# EAGLE design ESP32 DSP (EAGLE 9.6.2)
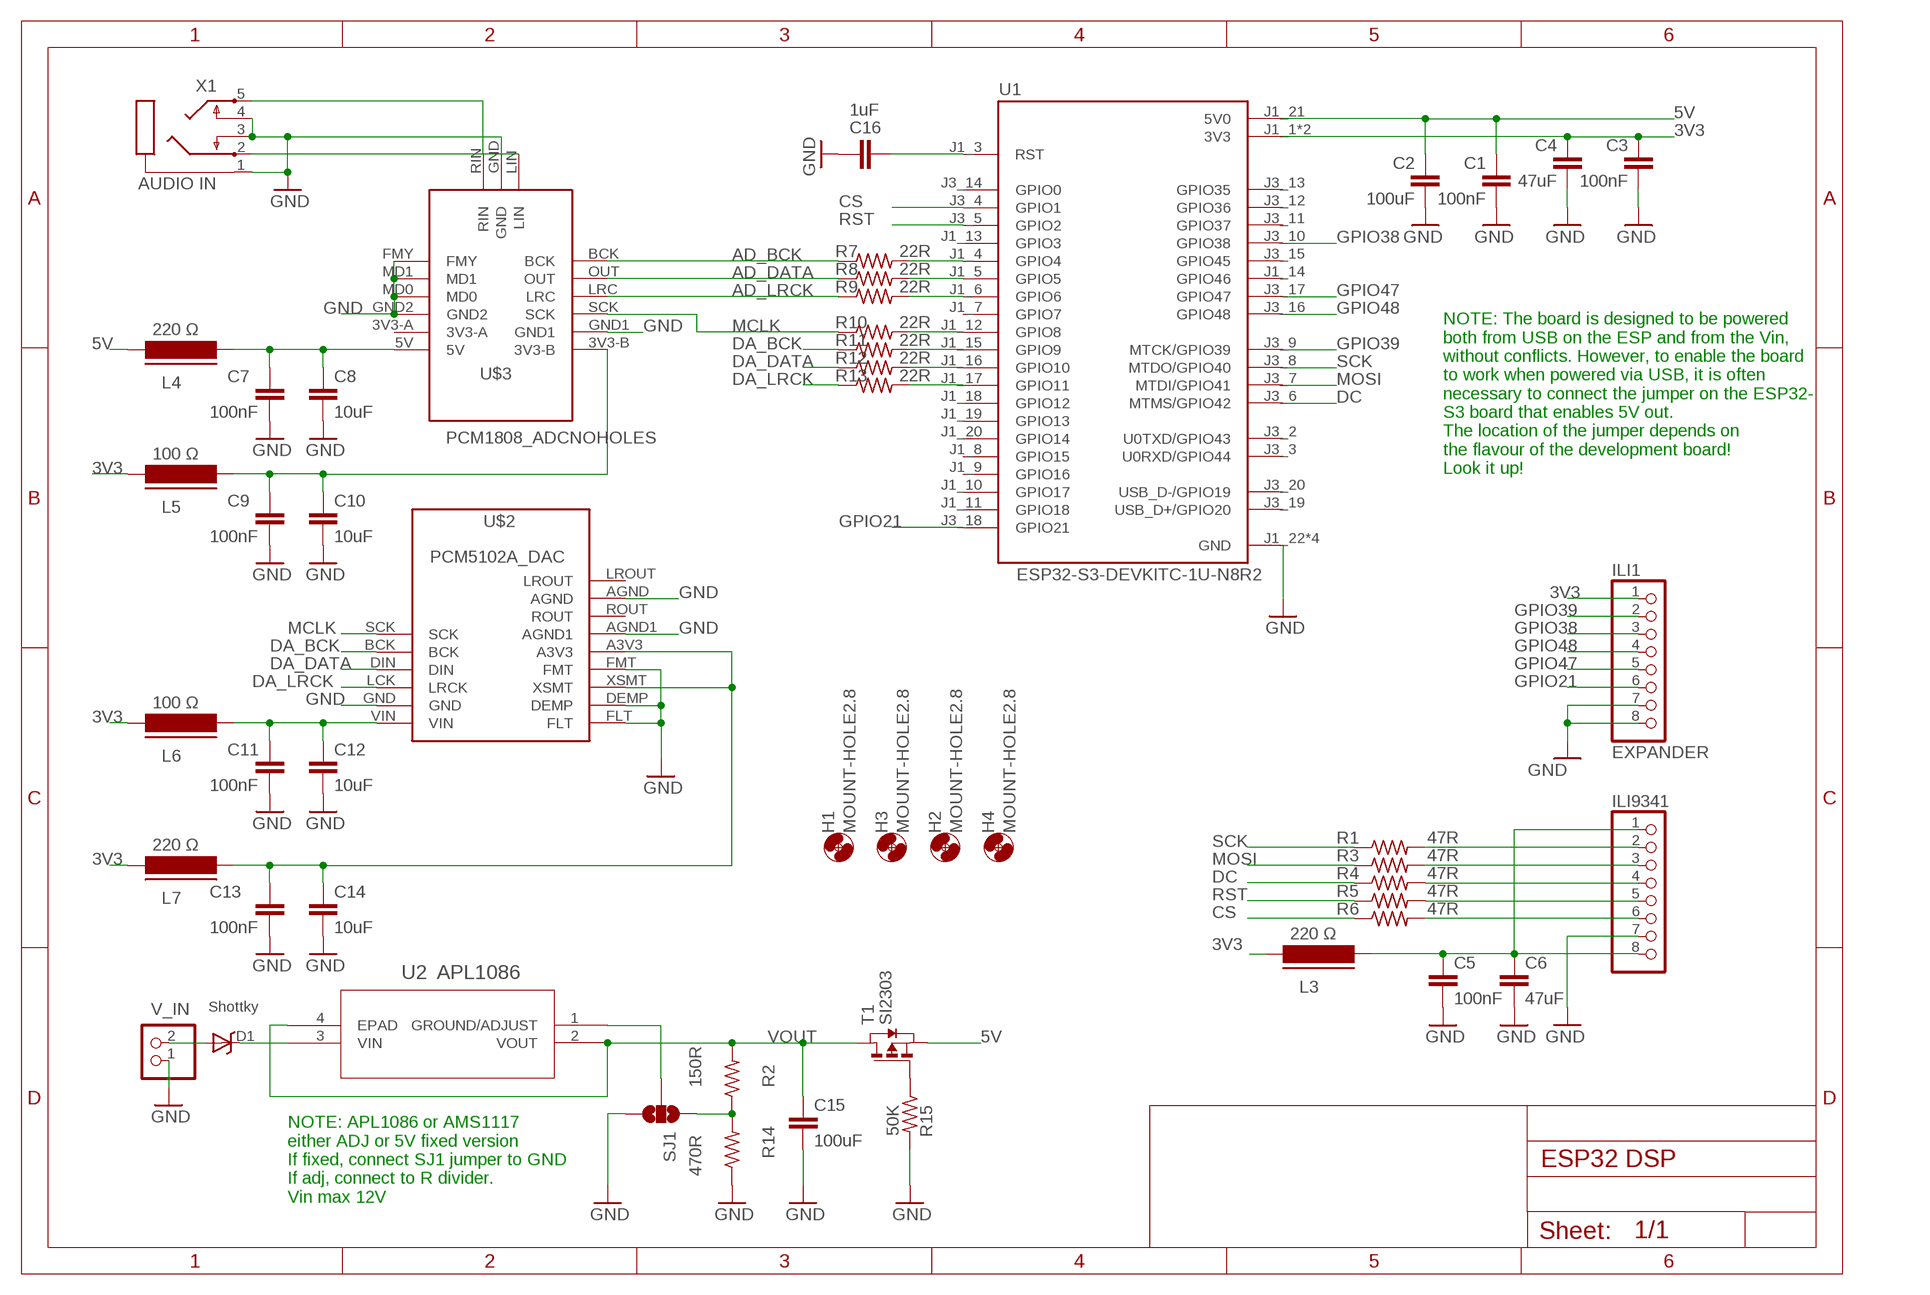
[diagram p0: schematic, sheet 1]

## Parts
C1  100nF  C-EUC0805  [C0805]
C2  100uF  C-EUC0805  [C0805]
C3  100nF  C-EUC0805  [C0805]
C4  47uF  C-EUC0805  [C0805]
C5  100nF  C-EUC0805  [C0805]
C6  47uF  C-EUC0805  [C0805]
C7  100nF  C-EUC0805  [C0805]
C8  10uF  C-EUC0805  [C0805]
C9  100nF  C-EUC0805  [C0805]
C10  10uF  C-EUC0805  [C0805]
C11  100nF  C-EUC0805  [C0805]
C12  10uF  C-EUC0805  [C0805]
C13  100nF  C-EUC0805  [C0805]
C14  10uF  C-EUC0805  [C0805]
C15  100uF  C-EUC0805  [C0805]
C16  1uF  C-EUC0805  [C0805]
D1  Shottky  DIODE-SCHOTTKYSMA-403D  [SMA-403D]
H1  MOUNT-HOLE2.8  [2,8]
H2  MOUNT-HOLE2.8  [2,8]
H3  MOUNT-HOLE2.8  [2,8]
H4  MOUNT-HOLE2.8  [2,8]
ILI1  EXPANDER  PINHD-1X8  [1X08]
ILI9341  PINHD-1X8  [1X08]
L3  220 Ω  FERRITE-0805  [FB805]
L4  220 Ω  FERRITE-0805  [FB805]
L5  100 Ω  FERRITE-0805  [FB805]
L6  100 Ω  FERRITE-0805  [FB805]
L7  220 Ω  FERRITE-0805  [FB805]
R1  47R  R-US_M0805  [M0805]
R2  150R  R-US_M0805  [M0805]
R3  47R  R-US_M0805  [M0805]
R4  47R  R-US_M0805  [M0805]
R5  47R  R-US_M0805  [M0805]
R6  47R  R-US_M0805  [M0805]
R7  22R  R-US_M0805  [M0805]
R8  22R  R-US_M0805  [M0805]
R9  22R  R-US_M0805  [M0805]
R10  22R  R-US_M0805  [M0805]
R11  22R  R-US_M0805  [M0805]
R12  22R  R-US_M0805  [M0805]
R13  22R  R-US_M0805  [M0805]
R14  470R  R-US_M0805  [M0805]
R15  50K  R-US_M0805  [M0805]
SJ1  SOLDERJUMPER_2WAYS  [SJ_3]
T1  SI2303  PMOSSOT23  [SOT-23]
U1  ESP32-S3-DEVKITC-1U-N8R2  [XCVR_ESP32-S3-DEVKITC-1U-N8R2]
U2  APL1086  [SOT_AMS_ADS]
U$2  PCM5102A_DAC  [I2S_PCM_5100_SOUNDCARD]
U$3  PCM1808_ADCNOHOLES  [CMJCU-1808-NOHOLES]
V_IN  5V  PINHD-1X2  [1X02]
X1  AUDIO IN  STEREOJACK  [STX3100]

## Nets
3V3: C3.1 C4.1 ILI1.1 L3.1 L5.1 L6.1 L7.1 U1.J1_1(3V3) U1.J1_2(3V3)
5V: C1.1 C2.1 L4.1 T1.2(S) U1.J1_21(5V0)
AD_BCK: R7.1 U$3.BCK
AD_DATA: R8.1 U$3.OUT
AD_LRCK: R9.1 U$3.LRC
CS: R6.1 U1.J3_4(GPIO1)
DA_BCK: R11.1 U$2.BCK
DA_DATA: R12.1 U$2.DIN
DA_LRCK: R13.1 U$2.LCK(LRCK)
DC: R4.1 U1.J3_6(MTMS/GPIO42)
GND: C1.2 C2.2 C3.2 C4.2 C5.2 C6.2 C7.2 C8.2 C9.2 C10.2 C11.2 C12.2 C13.2 C14.2 C15.2 C16.2 ILI1.7 ILI1.8 ILI9341.7 R14.1 R15.2 SJ1.3 U1.J1_22(GND) U1.J3_1(GND) U1.J3_21(GND) U1.J3_22(GND) U$2.AGND U$2.AGND1 U$2.DEMP U$2.FLT U$2.FMT U$2.GND U$3.FMY U$3.GND U$3.GND1 U$3.GND2 U$3.MD0 U$3.MD1 V_IN.1 X1.1 X1.3 X1.4
GPIO21: ILI1.6 U1.J3_18(GPIO21)
GPIO38: ILI1.3 U1.J3_10(GPIO38)
GPIO39: ILI1.2 U1.J3_9(MTCK/GPIO39)
GPIO47: ILI1.5 U1.J3_17(GPIO47)
GPIO48: ILI1.4 U1.J3_16(GPIO48)
MCLK: R10.1 U$2.SCK U$3.SCK
MOSI: R3.1 U1.J3_7(MTDI/GPIO41)
N$1: ILI9341.2 R1.2
N$2: ILI9341.3 R3.2
N$3: ILI9341.4 R4.2
N$4: ILI9341.5 R5.2
N$5: ILI9341.6 R6.2
N$6: C11.1 C12.1 L6.2 U$2.VIN
N$7: C13.1 C14.1 L7.2 U$2.A3V3 U$2.XSMT
N$8: U$3.RIN X1.5
N$9: U$3.LIN X1.2
N$10: R2.1 R14.2 SJ1.1
N$11: D1.C U2.3(VIN)
N$12: C16.1 U1.J1_3(RST)
N$13: SJ1.2 U2.1(GROUND/ADJUST)
N$85: R15.1 T1.3(G)
N$100: R7.2 U1.J1_4(GPIO4)
N$101: R8.2 U1.J1_5(GPIO5)
N$102: R9.2 U1.J1_6(GPIO6)
N$103: R10.2 U1.J1_12(GPIO8)
N$104: R11.2 U1.J1_15(GPIO9)
N$105: R12.2 U1.J1_16(GPIO10)
N$106: R13.2 U1.J1_17(GPIO11)
N$227: C9.1 C10.1 L5.2 U$3.3V3-B
N$244: C7.1 C8.1 L4.2 U$3.5V
N$333: C5.1 C6.1 ILI9341.1 ILI9341.8 L3.2
RST: R5.1 U1.J3_5(GPIO2)
SCK: R1.1 U1.J3_8(MTDO/GPIO40)
V_IN: D1.A V_IN.2
VOUT: C15.1 R2.2 T1.1(D) U2.2(VOUT) U2.4(EPAD)
Unconnected: U1.J1_7(GPIO7) U1.J1_8(GPIO15) U1.J1_9(GPIO16) U1.J1_10(GPIO17) U1.J1_11(GPIO18) U1.J1_13(GPIO3) U1.J1_14(GPIO46) U1.J1_18(GPIO12) U1.J1_19(GPIO13) U1.J1_20(GPIO14) U1.J3_2(U0TXD/GPIO43) U1.J3_3(U0RXD/GPIO44) U1.J3_11(GPIO37) U1.J3_12(GPIO36) U1.J3_13(GPIO35) U1.J3_14(GPIO0) U1.J3_15(GPIO45) U1.J3_19(USB_D+/GPIO20) U1.J3_20(USB_D-/GPIO19) U$2.LROUT U$2.ROUT U$3.3V3-A

## Notes on the sheet
- NOTE: The board is designed to be powered 
  both from USB on the ESP and from the Vin, 
  without conflicts. However, to enable the board 
  to work when powered via USB, it is often 
  necessary to connect the jumper on the ESP32-
  S3 board that enables 5V out. 
  The location of the jumper depends on 
  the flavour of the development board!
  Look it up!
- NOTE: APL1086 or AMS1117
  either ADJ or 5V fixed version
  If fixed, connect SJ1 jumper to GND
  If adj, connect to R divider.
  Vin max 12V

## Library data of the parts
C1-C16 = rcl:C-EU: CAPACITOR, European symbol
D1 = Ai_DiscreteSemis:DIODE-SCHOTTKY: Commonly MBRA140.
H1-H4 = holes:MOUNT-HOLE: MOUNTING HOLE with drill center marker
ILI1 ILI9341 = pinhead:PINHD-1X8: PIN HEADER
L3-L7 = Dangerous Prototypes_devices:FERRITE: Ferrite bead in various packages
R1-R15 = adafruit:R-US_: RESISTOR, American symbol
SJ1 = SparkFun-Passives:SOLDERJUMPER_2WAY: Solder Jumper 2 way solder jumper
T1 = zetex:PMOSSOT23: MOS FET; OC_FARNELL: unknown; OC_NEWARK: unknown
U1 = ESP32-S3-DEVKITC-1U-N8R2:ESP32-S3-DEVKITC-1U-N8R2: Check availability <https://pricing.snapeda.com/parts/ESP32-S3-DEVKITC-1U-N8R2/Espressif%20Systems/view-part?ref=eda>; AVAILABILITY: In Stock; CHECK_PRICES: https://www.snapeda.com/parts/ESP32-S3-DEVKITC-1U-N8R2/Espressif+Systems/view-part/?ref=eda; DESCRIPTION: The ESP32-S3-DEVKITC-1U-N8R2 Evaluation Board from Espressif Systems is a versatile development platform designed for wireless communication applications. It features the ESP32-S3-WROOM-1U-N8R2 transceiver, supporting 802.11 b/g/n Wi-Fi and Bluetooth® 5.x BLE at 2.4GHz, ensuring reliable connectivity. Equipped with 8MB Quad SPI Flash and 2MB Quad SPI, along with 512KB SRAM and 384KB ROM, the board provides ample memory for handling complex tasks efficiently.; MF: Espressif Systems; MP: ESP32-S3-DEVKITC-1U-N8R2; PACKAGE: None; PRICE: None; SNAPEDA_LINK: https://www.snapeda.com/parts/ESP32-S3-DEVKITC-1U-N8R2/Espressif+Systems/view-part/?ref=snap
U2 = APL1086:APL1086; COPYRIGHT: Copyright (C) 2025 Ultra Librarian. All rights reserved.; MANUFACTURER_NAME: Advanced Monolithic Systems; MANUFACTURER_PART_NUMBER: AMS1117-3.3
U$2 = PCM5102A Module:PCM5102A_DAC
U$3 = CJMCU-1808:PCM1808_ADC
V_IN = pinhead:PINHD-1X2: PIN HEADER
X1 = adafruit:STEREOJACK: MIC/HEADPHONE JACK Stereo jack with two switches. Kycon STX3100, CUI SJ1-3555NG and/or 4UCon 05544

## Board
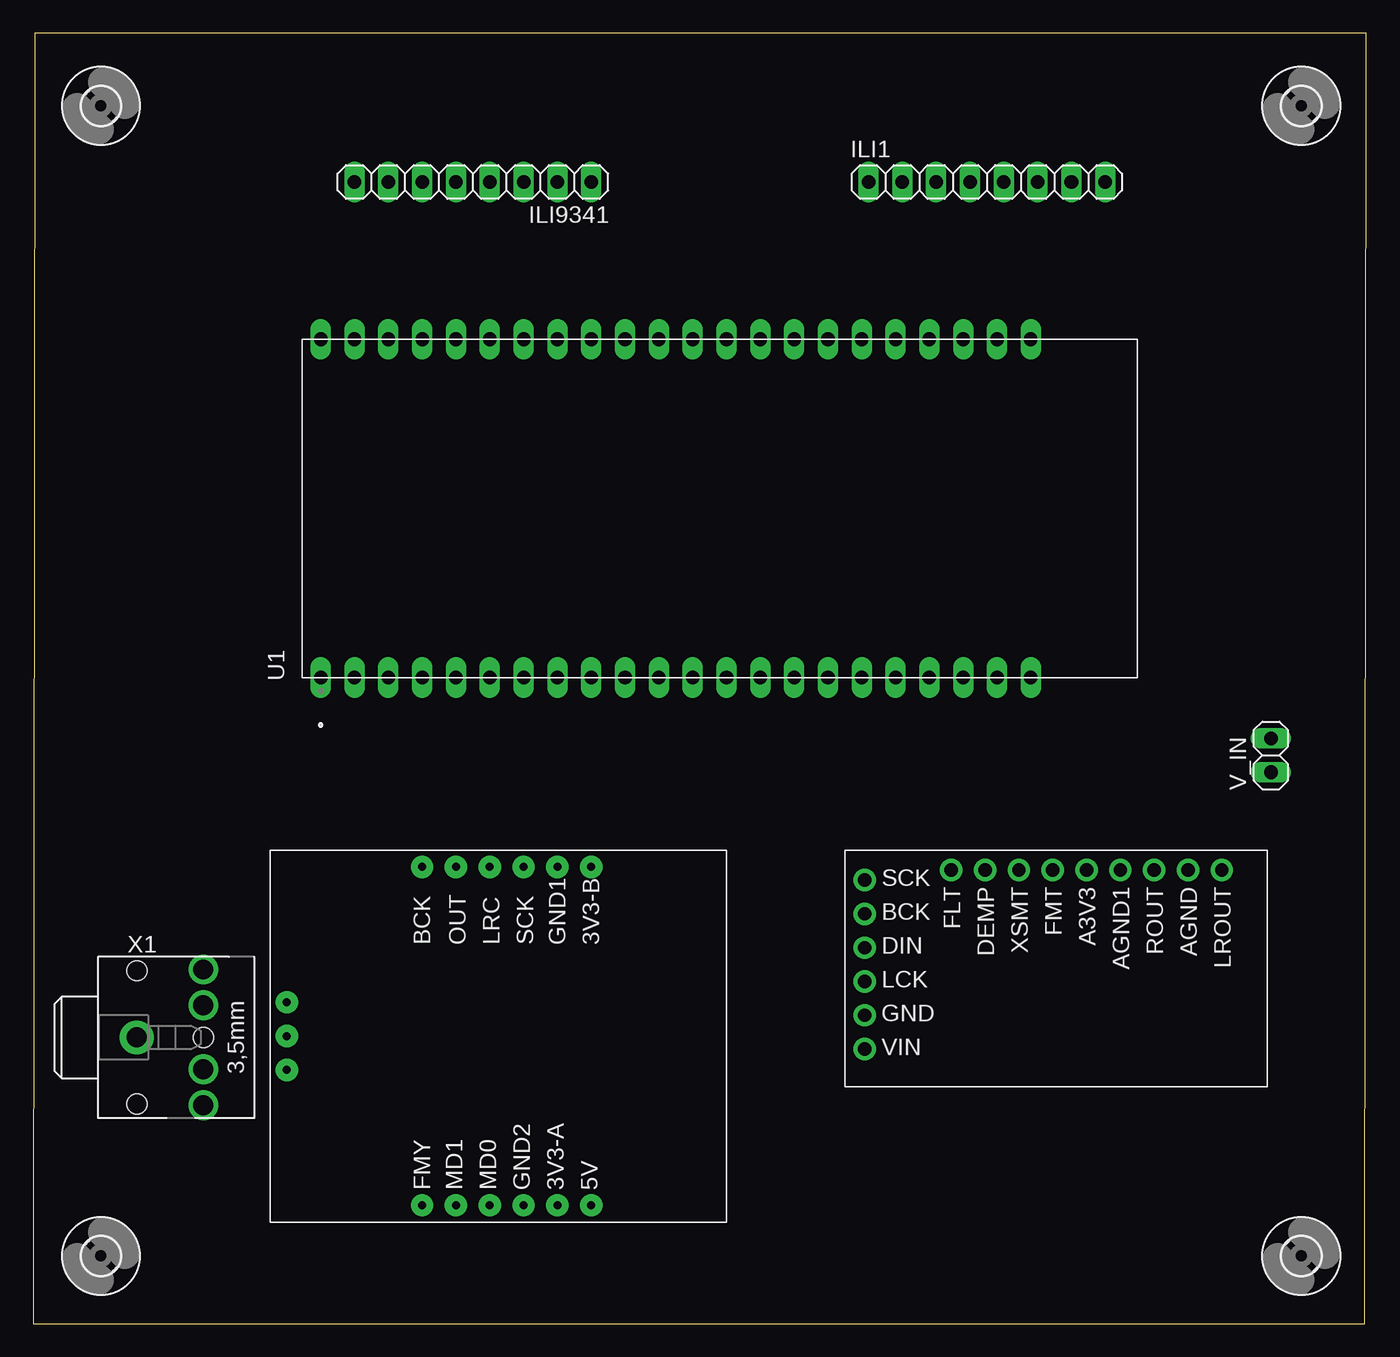
[diagram p1: board, top side]
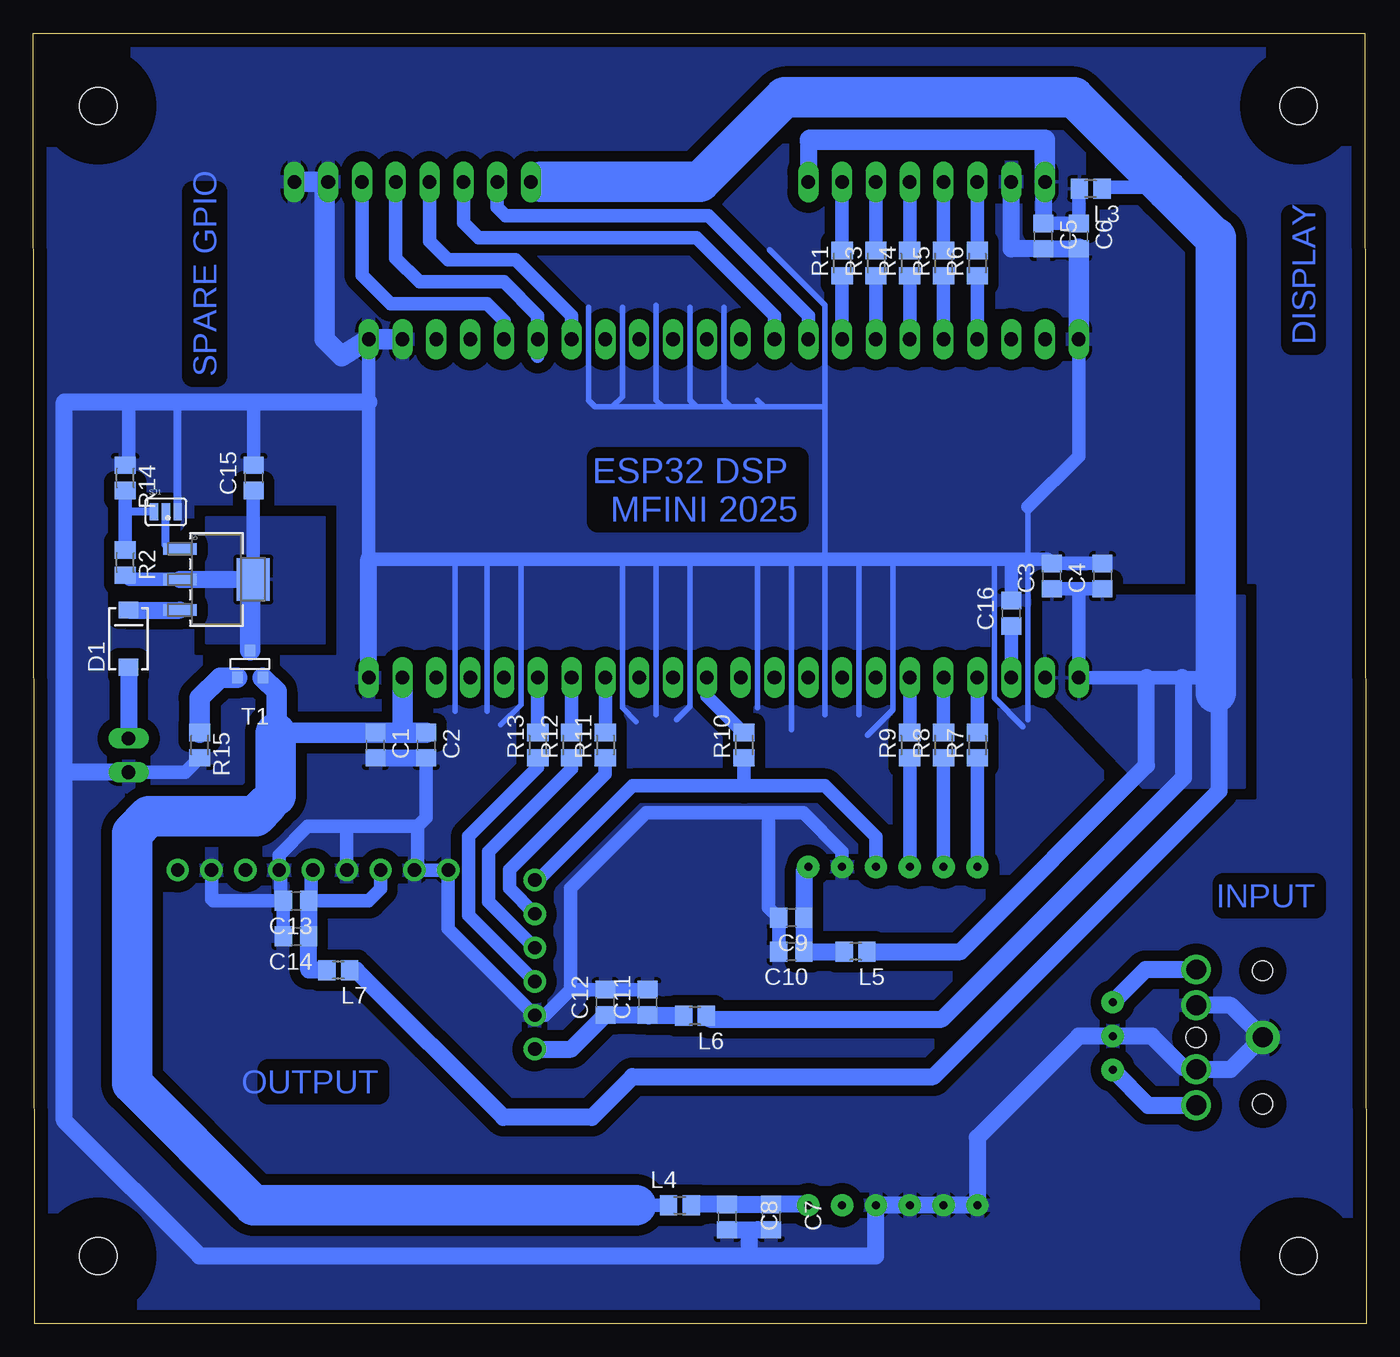
[diagram p2: board, bottom side, seen from below]

Size 100.13 x 96.89 mm. Coordinates in mm from the lower left corner, seen from the top.
Outline: 0,0 100,0 100.13,96.89 0.13,96.89 0,0
Copper layers (1*16): Top 0.035mm / dielectric 1.5mm / Bottom 0.035mm
Design rules "default": minimum track width 6mil, minimum drill 0.35mm, track to track 6mil, track to pad 6mil, pad to pad 6mil, via to via 6mil, smd to smd 6mil, copper to edge 40mil, drill to drill 6mil, minimum pad ring 10mil, minimum via ring 8mil, stop-mask expansion 4mil, vias tented up to drill 0mil, thermal gap 10mil

### Footprints (pad centres in the part's own frame; a part is rotated, then mirrored left to right if it is on the bottom)
C0805 = smd 1.3 x 1.5: 1 -0.95,0; 2 0.95,0
SMA-403D = smd 1.27 x 1.47: A -2.15,0; C 2.15,0
2,8 = hole 2.8: 0,0
1X08 = drill 1.016 long: 1 -8.89,0; 2 -6.35,0; 3 -3.81,0; 4 -1.27,0; 5 1.27,0; 6 3.81,0; 7 6.35,0; 8 8.89,0
FB805 = smd 1.3 x 1.5: 1 -0.85,0; 2 0.85,0
M0805 = smd 1.3 x 1.6: 1 -0.95,0; 2 0.95,0
SJ_3 = smd 0.635 x 1.27: 1 -0.889,0; 2 0,0; 3 0.889,0
SOT-23 = smd 0.787 x 0.889: 1 0.025,-1.016; 2 -0.94,1.016; 3 0.991,1.016
XCVR_ESP32-S3-DEVKITC-1U-N8R2 = drill 1.02 long: J1_1 -12.7,29.97; J1_2 -12.7,27.43; J1_3 -12.7,24.89; J1_4 -12.7,22.35; J1_5 -12.7,19.81; J1_6 -12.7,17.27; J1_7 -12.7,14.73; J1_8 -12.7,12.19; J1_9 -12.7,9.65; J1_10 -12.7,7.11; J1_11 -12.7,4.57; J1_12 -12.7,2.03; J1_13 -12.7,-0.51; J1_14 -12.7,-3.05; J1_15 -12.7,-5.59; J1_16 -12.7,-8.13; J1_17 -12.7,-10.67; J1_18 -12.7,-13.21; J1_19 -12.7,-15.75; J1_20 -12.7,-18.29; J1_21 -12.7,-20.83; J1_22 -12.7,-23.37; J3_1 12.7,29.97; J3_2 12.7,27.43; J3_3 12.7,24.89; J3_4 12.7,22.35; J3_5 12.7,19.81; J3_6 12.7,17.27; J3_7 12.7,14.73; J3_8 12.7,12.19; J3_9 12.7,9.65; J3_10 12.7,7.11; J3_11 12.7,4.57; J3_12 12.7,2.03; J3_13 12.7,-0.51; J3_14 12.7,-3.05; J3_15 12.7,-5.59; J3_16 12.7,-8.13; J3_17 12.7,-10.67; J3_18 12.7,-13.21; J3_19 12.7,-15.75; J3_20 12.7,-18.29; J3_21 12.7,-20.83; J3_22 12.7,-23.37
SOT_AMS_ADS = smd 0.889 x 2.489: 1 -2.29,-2.756; 2 0,-2.756; 3 2.29,-2.756 | smd 3.2 x 2.489: 4 0,2.756
I2S_PCM_5100_SOUNDCARD = drill 1 pad 1.676: A3V3 1.5,18.16; AGND 1.5,25.78; AGND1 1.5,20.7; BCK 4.79,1.5; DEMP 1.5,10.54; DIN 7.33,1.5; FLT 1.5,8; FMT 1.5,15.62; GND 12.41,1.5; LCK 9.87,1.5; LROUT 1.5,28.32; ROUT 1.5,23.24; SCK 2.25,1.5; VIN 14.95,1.5; XSMT 1.5,13.08
CMJCU-1808-NOHOLES = drill 0.6 pad 1.676: 3V3-A 1.27,12.7; 3V3-B 26.67,10.16; 5V 1.27,10.16; BCK 26.67,22.86; FMY 1.27,22.86; GND 13.97,33.02; GND1 26.67,12.7; GND2 1.27,15.24; LIN 16.51,33.02; LRC 26.67,17.78; MD0 1.27,17.78; MD1 1.27,20.32; OUT 26.67,20.32; RIN 11.43,33.02; SCK 26.67,15.24
1X02 = drill 1.016 long: 1 -1.27,0; 2 1.27,0
STX3100 = drill 1.5 pad 2.54: 1 2.7,-0.1 | drill 1.5: 2 7.7,5; 3 7.7,2.3; 4 7.7,-2.5; 5 7.7,-5.2 | hole 1.5: 2.7,4.9; 2.7,-5.1; 7.7,-0.1

### Placement (x,y rotation side)
C1  74.42,43.43 270 bottom
C2  70.61,43.43 270 bottom
C3  23.62,56.13 90 bottom
C4  19.81,56.13 90 bottom
C5  24.26,81.66 270 bottom
C6  21.59,81.66 270 bottom
C7  44.7,8 270 bottom
C8  48.01,8 270 bottom
C9  43.18,30.48 180 bottom
C10  43.18,27.94 180 bottom
C11  53.98,24.13 90 bottom
C12  57.15,24.13 90 bottom
C13  80.39,31.75 180 bottom
C14  80.39,29.08 180 bottom
C15  83.57,63.5 90 bottom
C16  26.67,53.34 90 bottom
D1  92.96,51.44 90 bottom
H1  5.08,91.44 0 top
H2  5.08,5.08 0 top
H3  95.25,91.44 0 top
H4  95.25,5.08 0 top
ILI1  71.63,85.72 0 top
ILI9341  33.02,85.72 180 top
L3  20.7,85.22 180 bottom
L4  51.56,8.89 0 bottom
L5  38.35,27.94 180 bottom
L6  50.42,23.11 180 bottom
L7  77.22,26.54 180 bottom
R1  39.37,79.63 90 bottom
R2  93.22,57.15 270 bottom
R3  36.83,79.63 90 bottom
R4  34.29,79.63 90 bottom
R5  31.75,79.63 90 bottom
R6  29.21,79.63 90 bottom
R7  29.21,43.43 90 bottom
R8  31.75,43.43 90 bottom
R9  34.29,43.43 90 bottom
R10  46.74,43.43 90 bottom
R11  57.15,43.43 90 bottom
R12  59.69,43.43 90 bottom
R13  62.23,43.43 90 bottom
R14  93.22,63.5 270 bottom
R15  87.63,43.43 270 bottom
SJ1  90.17,60.96 0 bottom
T1  83.82,49.53 180 bottom
U1  51.56,61.21 90 top
U2  86.36,55.88 270 bottom
U$2  60.96,35.56 270 top
U$3  52.07,7.62 90 top
V_IN  92.96,42.67 90 top
X1  5.08,21.59 0 top

### Tracks (layer width: path | path; a pad name or v marks a point on that pad's centre or on a via)
3V3
  Bottom 0.254: L6.1 49.31,22.86
  Bottom 1.016: C4.1 21.59,55.18 | 21.59,55.18 C3.1 | 21.59,55.18 U1.J1_1 16.51,48.51 13.84,48.51 11.46,48.51 11.3,47.36 | L3.1 19.72,85.34 15.24,85.34 14.99,85.09 | ILI1.1 61.98,85.72
  Bottom 1.27: L5.1 30.48,27.94 16.51,41.91 16.51,48.51 | 49.31,22.86 31.88,22.86 13.72,41.02 13.72,48.39 13.84,48.51 | L7.1 75.86,26.54 64.81,15.49 58.17,15.49 55.12,18.54 32.51,18.54 11.05,40.01 11.05,47.11 11.3,47.36
  Bottom 3.048: 11.3,81.53 11.3,81.41 | 11.3,81.41 11.3,47.36 | 61.98,85.72 50.04,85.72 43.69,92.08 21.97,92.08 14.99,85.09 11.3,81.41
  pour Bottom (isolate 0.813): 24.64,48.51 16.8,40.26 9.14,40.26 9.14,54.61 24.64,54.61
5V
  Bottom 1.016: L4.1 54.86,8.89 | 72.39,44.39 72.39,44.38 | 81.86,44.38 81.92,44.33 | 81.92,39.62 82.55,38.99
  Bottom 1.524: C2.1 72.39,44.38 C1.1 81.86,44.38 81.86,47.5 T1.2 | U1.J1_21 72.39,44.39
  Bottom 3.048: 54.86,8.89 83.57,8.89 92.71,18.03 92.71,36.83 91.44,38.1 83.44,38.1 82.55,38.99 | 81.92,44.33 81.92,39.62
AD_BCK
  Bottom 1.016: R7.1 U$3.BCK
AD_DATA
  Bottom 1.016: U$3.OUT R8.1
AD_LRCK
  Bottom 1.016: R9.1 U$3.LRC
CS
  Bottom 1.016: R6.1 U1.J3_4
DA_BCK
  Bottom 1.016: U$2.BCK 64.36,32.67 64.36,34.07 57.18,41.25 57.18,42.45 R11.1
DA_DATA
  Bottom 1.016: U$2.DIN 65.92,31.68 65.92,35.44 59.69,41.66 R12.1
DA_LRCK
  Bottom 1.016: U$2.LCK 67.44,30.67 67.44,36.58 62.23,41.79 R13.1
DC
  Bottom 1.016: U1.J3_6 R4.1
GND
  Bottom 0.254: C13.2 81.53,31.94 | 44.89,38.29 44.96,38.35
  Bottom 0.406: 53.34,57.4 53.34,45.72 | 66.04,57.4 66.04,45.97 | 68.45,57.4 68.45,45.97 | 45.72,57.4 45.72,46.23 | 63.5,57.4 63.5,46.48 65.02,44.96 | 40.64,45.72 40.64,57.4 40.64,68.83 | 43.18,57.4 43.18,44.58 | 38.1,57.4 38.1,45.72 | 35.56,57.4 35.56,46.1 37.47,44.2 | 25.4,61.34 25.4,57.4 25.4,45.34 | 27.94,57.4 27.94,46.99 25.78,44.83 | 50.8,57.4 50.8,46.35 51.82,45.34 | 55.88,57.4 55.88,46.23 54.86,45.21 | 40.64,68.83 40.64,76.45 44.83,80.64 | 58.42,76.33 58.42,69.34 57.91,68.83 56.64,68.83 | 40.64,68.83 45.21,68.83 | 45.21,68.83 47.75,68.83 | 47.75,68.83 50.29,68.83 | 50.29,68.83 52.83,68.83 | 52.83,68.83 56.64,68.83 | 56.64,68.83 55.88,69.6 55.88,76.33 | 52.83,68.83 53.34,69.34 53.34,76.45 | 50.29,68.83 50.8,69.34 50.8,76.33 | 47.75,68.83 48.26,69.34 48.26,76.33 | 45.21,68.83 45.72,69.34
  Bottom 0.61: SJ1.3 89.28,69.09
  Bottom 0.813: 89.28,69.09 89.15,69.22
  Bottom 1.016: 81.53,31.94 81.53,33.93 U$2.AGND1 81.66,35.18 79.5,37.34 76.58,37.34 | U$2.AGND 86.74,31.88 86.61,31.75 C13.2 C14.2 | 59.77,25.08 61.7,23.15 U$2.GND 68.96,29.65 U$2.FLT U$2.DEMP 71.25,34.31 71.25,37.34 | 26.67,57.4 25.4,57.4 23.94,57.4 C3.2 C4.2 | 26.67,57.4 27.94,57.4 35.56,57.4 38.1,57.4 40.64,57.4 43.18,57.4 45.72,57.4 50.8,57.4 53.34,57.4 55.88,57.4 63.5,57.4 66.04,57.4 68.45,57.4 74.93,57.4 74.93,69.22 U1.J3_22 | U1.J3_1 21.59,65.15 25.4,61.34 | U$2.FMT 76.58,37.34 | 76.58,37.34 71.25,37.34 | C10.2 C9.2 44.89,31.24 44.89,38.29 | C11.2 C12.2 59.77,25.08 | U$3.GND1 39.37,35.43 42.29,38.35 44.96,38.35 54.1,38.35 59.77,32.69 59.77,25.08 | X1.4 12.91,19.22 13.72,19.22 | 78.23,85.47 ILI1.7 | 45.72,7.05 46.35,6.42 | C6.2 | C5.2 | R14.1 92.96,64.45 92.96,69.22 | C15.2 83.57,69.22 | V_IN.1 88.71,41.4 R15.2 | C16.2 26.67,57.4 | 71.25,37.34 70.61,37.97 C2.2
  Bottom 1.27: U1.J1_22 74.93,57.4 | C8.2 45.72,7.05 C7.2 | X1.4 10.18,19.09 X1.1 10.18,23.89 X1.3 | 13.72,19.22 16.1,21.59 U$3.GND 21.59,21.59 29.21,13.97 U$3.FMY U$3.MD1 U$3.MD0 U$3.GND2 36.83,5.08 46.35,5.08 | 74.93,69.22 83.57,69.22 89.15,69.22 92.96,69.22 97.79,69.22 97.79,41.4 | 97.79,41.4 97.79,15.24 87.63,5.08 46.35,5.08 | C1.2 C2.2 | ILI9341.7 26.67,80.71 C5.2 | 46.35,6.42 46.35,5.08 | V_IN.1 97.79,41.4 | C5.2 C6.2
  Bottom 1.524: U1.J3_21 U1.J3_22 76.96,72.64 78.23,73.91 78.23,85.47 | ILI1.7 ILI1.8 | U1.J3_1 C6.2
  pour Bottom (isolate 0.813, rank 3): 0,96.52 0,0 100.33,0 100.33,96.52
  pour Bottom (isolate 0.813): 35.69,46.23 35.69,37.59 45.85,37.59 45.85,46.23
  pour Bottom (isolate 0.813): 78.99,36.96 63.75,36.96 63.75,46.23 78.99,46.23
  pour Bottom (isolate 0.813): 49.53,46.23 55.75,46.23 55.75,41.15 51.05,41.15 49.53,42.67
  pour Bottom (isolate 0.813, rank 2): 39.75,57.28 39.75,86.49 41.78,88.52 81.79,88.52 81.79,56.52 40.51,56.52
GPIO21
  Bottom 1.016: U1.J3_18 64.77,75.31 66.04,76.58 73.28,76.58 75.44,78.74 ILI1.6
GPIO38
  Bottom 1.016: ILI1.3 67.82,82.68 66.67,81.53 50.29,81.53 44.45,75.69 U1.J3_10
GPIO39
  Bottom 1.016: U1.J3_9 41.91,75.69 49.4,83.19 64.64,83.19 65.28,83.82 ILI1.2
GPIO47
  Bottom 1.016: U1.J3_17 62.23,72.65 62.23,75.69 64.77,78.23 71.12,78.23 72.9,80.01 ILI1.5
GPIO48
  Bottom 1.016: U1.J3_16 59.69,75.69 63.88,79.88 68.96,79.88 70.36,81.28 ILI1.4
MCLK
  Bottom 1.016: 46.74,40.39 40.64,40.39 36.83,36.58 U$3.SCK | 46.74,40.39 55.12,40.39 62.19,33.31 U$2.SCK | R10.1 46.74,40.39
MOSI
  Bottom 1.016: R3.1 U1.J3_7
N$1
  Bottom 1.016: ILI9341.2 R1.2
N$2
  Bottom 1.016: ILI9341.3 R3.2
N$3
  Bottom 1.016: ILI9341.4 R4.2
N$4
  Bottom 1.016: ILI9341.5 R5.2
N$5
  Bottom 1.016: ILI9341.6 R6.2
N$6
  Bottom 0.254: 53.91,23.11 C11.1
  Bottom 1.27: C11.1 55.5,23.18 C12.1 59.72,20.61 U$2.VIN | L6.2 53.91,23.11
N$7
  Bottom 0.254: 79.25,31.94 C13.1
  Bottom 1.016: U$2.A3V3 79.25,33.93 79.25,31.94 | C13.1 74.93,31.75 74.04,32.64 U$2.XSMT
  Bottom 1.27: C13.1 C14.1 79.44,26.54 L7.2
N$8
  Bottom 1.27: X1.5 16.39,16.39 U$3.RIN
N$9
  Bottom 1.27: X1.2 16.59,26.59 U$3.LIN
N$10
  Bottom 0.61: SJ1.1 93.22,60.96
  Bottom 1.016: R14.2 93.22,60.96 R2.1
N$11
  Bottom 1.016: U2.3
  Bottom 1.27: D1.C U2.3
N$12
  Bottom 1.016: U1.J1_3 C16.1
N$13
  Bottom 0.61: U2.1 89.92,58.17 90.17,58.42 SJ1.2
N$85
  Bottom 1.524: T1.3 86.11,48.51 87.63,46.99 R15.1
N$100
  Bottom 1.016: U1.J1_4 R7.2
N$101
  Bottom 1.016: U1.J1_5 R8.2
N$102
  Bottom 1.016: U1.J1_6 R9.2
N$103
  Bottom 1.016: U1.J1_12 49.53,47.12 46.8,44.38 R10.2
N$104
  Bottom 1.016: U1.J1_15 R11.2
N$105
  Bottom 1.016: R12.2 U1.J1_16
N$106
  Bottom 1.016: R13.2 U1.J1_17
N$227
  Bottom 0.254: U$3.3V3-B 42.23,33.97
  Bottom 1.27: 42.23,33.97 C9.1 C10.1 L5.2
N$244
  Bottom 1.016: U$3.5V 41.91,8.95 | 50.65,8.95 L4.2
  Bottom 1.27: 41.91,8.95 C7.1 C8.1 50.65,8.95
N$333
  Bottom 1.016: L3.2 21.59,85.18 C6.1 C5.1
  Bottom 1.27: ILI9341.8 24.26,85.6 C5.1 | 41.78,88.9 41.91,88.77 ILI9341.1
  Bottom 1.524: ILI9341.8 24.13,88.9 41.78,88.9
  pour Bottom: 24.89,82.8 21.08,82.8 21.08,87.88 22.73,89.53 24.89,89.53
RST
  Bottom 1.016: U1.J3_5 R5.1
SCK
  Bottom 1.016: U1.J3_8 R1.1
V_IN
  Bottom 1.27: D1.A V_IN.2
VOUT
  Bottom 1.016: C15.1 83.6,62.51 U2.4 83.84,55.64 | R2.2 92.9,55.88 U2.2
  Bottom 1.27: U2.2 U2.4
  Bottom 1.524: 83.84,55.64 T1.1
  pour Bottom (isolate 0.813): 78.23,60.58 78.23,51.05 87.12,51.05 87.12,60.58

### Text on the board
Bottom: DISPLAY | SPARE GPIO | ESP32 DSP / MFINI 2025 | INPUT | OUTPUT